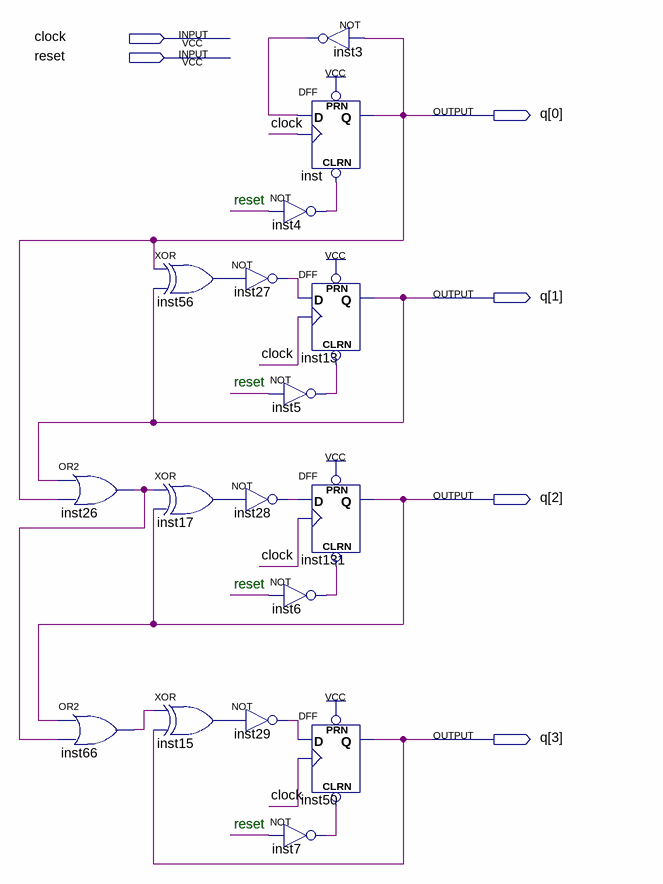
[diagram p0: schematic sheet]
// Quartus schematic downCounter4bits.bdf as structural Verilog: 17 symbols, 6 pins
module downCounter4bits (
  input  clock,
  input  reset,
  output [3:0] q
);

  wire inst3_out, inst4_out, inst5_out, inst6_out, inst7_out, inst15_out, inst17_out, inst26_out, inst27_out,
       inst28_out, inst29_out, inst56_out, inst66_out;

  or inst26 (inst26_out, q[1], q[0]);
  or inst66 (inst66_out, q[2], inst26_out);
  xor inst56 (inst56_out, q[0], q[1]);
  xor inst17 (inst17_out, inst26_out, q[2]);
  xor inst15 (inst15_out, inst66_out, q[3]);
  not inst27 (inst27_out, inst56_out);
  not inst28 (inst28_out, inst17_out);
  not inst29 (inst29_out, inst15_out);
  not inst3 (inst3_out, q[0]);
  DFF inst (.CLRN(inst4_out), .CLK(clock), .D(inst3_out), .PRN(1'b1), .Q(q[0]));
  not inst4 (inst4_out, reset);
  DFF inst13 (.CLRN(inst5_out), .CLK(clock), .D(inst27_out), .PRN(1'b1), .Q(q[1]));
  not inst5 (inst5_out, reset);
  DFF inst131 (.CLRN(inst6_out), .CLK(clock), .D(inst28_out), .PRN(1'b1), .Q(q[2]));
  not inst6 (inst6_out, reset);
  DFF inst50 (.CLRN(inst7_out), .CLK(clock), .D(inst29_out), .PRN(1'b1), .Q(q[3]));
  not inst7 (inst7_out, reset);

  // Notes on the sheet:
  //   reset
  //   reset
  //   reset
  //   reset
endmodule
